# EAGLE design hdmi_trigger_interface (EAGLE 9.3.1)

## Sheet 1 of 4: MojoV3 Connections
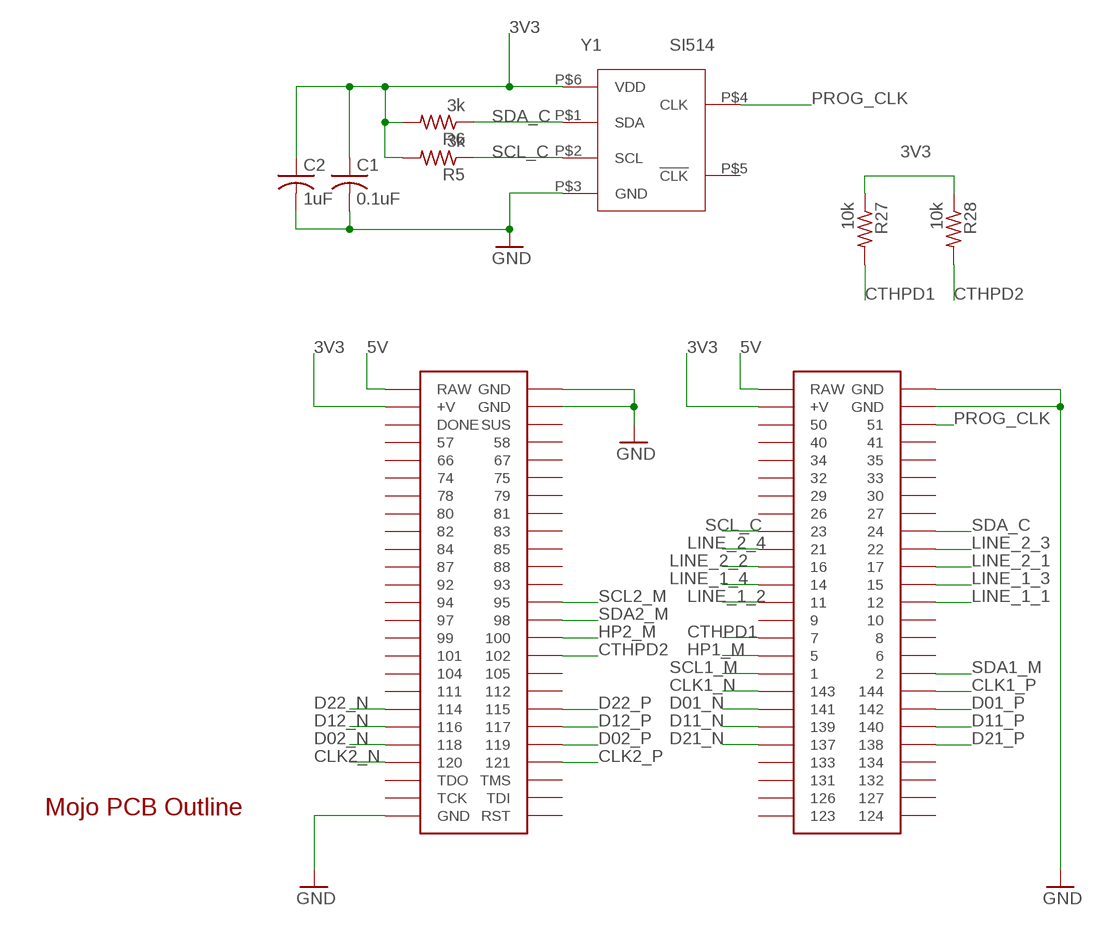
[diagram p0: schematic, sheet 1]

### Parts
C1  0.1uF  C-USC0603  [C0603]
C2  1uF  C-USC0603  [C0603]
R5  3k  R-US_R0603  [R0603]
R6  3k  R-US_R0603  [R0603]
R27  10k  R-US_R0603  [R0603]
R28  10k  R-US_R0603  [R0603]
U$1  MOJOV3  [MOJO_V3]
U$2  MOJO_OUTLINE  [MOJO_OUTLINE]
Y1  SI514  [XTAL-6PIN]

### Nets
3V3: C1.1 C2.1 R5.2 R6.2 R27.1 R28.1 U$1.V@1(+V) U$1.V@2(+V) Y1.P$6(VDD) ; also sheet 2,4
5V: U$1.RAW@1(RAW) U$1.RAW@2(RAW) ; also sheet 2
CLK1_N [diff]: U$1.143 ; also sheet 2,3
CLK1_P [diff]: U$1.144 ; also sheet 2,3
CLK2_N [diff]: U$1.120 ; also sheet 2,3
CLK2_P [diff]: U$1.121 ; also sheet 2,3
CTHPD1: R27.2 U$1.7 ; also sheet 2
CTHPD2: R28.2 U$1.102 ; also sheet 2
D01_N [diff]: U$1.141 ; also sheet 2,3
D01_P [diff]: U$1.142 ; also sheet 2,3
D02_N [diff]: U$1.118 ; also sheet 2,3
D02_P [diff]: U$1.119 ; also sheet 2,3
D11_N [diff]: U$1.139 ; also sheet 2,3
D11_P [diff]: U$1.140 ; also sheet 2,3
D12_N [diff]: U$1.116 ; also sheet 2,3
D12_P [diff]: U$1.117 ; also sheet 2,3
D21_N [diff]: U$1.137 ; also sheet 2,3
D21_P [diff]: U$1.138 ; also sheet 2,3
D22_N [diff]: U$1.114 ; also sheet 2,3
D22_P [diff]: U$1.115 ; also sheet 2,3
GND: C1.2 C2.2 U$1.GND@1(GND) U$1.GND@2(GND) U$1.GND@3(GND) U$1.GND@4(GND) U$1.GND@6(GND) Y1.P$3(GND) ; also sheet 2,3,4
HP1_M: U$1.5 ; also sheet 2
HP2_M: U$1.100 ; also sheet 2
LINE_1_1: U$1.12 ; also sheet 4
LINE_1_2: U$1.11 ; also sheet 4
LINE_1_3: U$1.15 ; also sheet 4
LINE_1_4: U$1.14 ; also sheet 4
LINE_2_1: U$1.17 ; also sheet 4
LINE_2_2: U$1.16 ; also sheet 4
LINE_2_3: U$1.22 ; also sheet 4
LINE_2_4: U$1.21 ; also sheet 4
PROG_CLK: U$1.51 Y1.P$4(CLK)
SCL1_M: U$1.1 ; also sheet 2
SCL2_M: U$1.95 ; also sheet 2
SCL_C: R5.1 U$1.23 Y1.P$2(SCL)
SDA1_M: U$1.2 ; also sheet 2
SDA2_M: U$1.98 ; also sheet 2
SDA_C: R6.1 U$1.24 Y1.P$1(SDA)
Unconnected: U$1.6 U$1.8 U$1.9 U$1.10 U$1.26 U$1.27 U$1.29 U$1.30 U$1.32 U$1.33 U$1.34 U$1.35 U$1.40 U$1.41 U$1.50 U$1.57 U$1.58 U$1.66 U$1.67 U$1.74 U$1.75 U$1.78 U$1.79 U$1.80 U$1.81 U$1.82 U$1.83 U$1.84 U$1.85 U$1.87 U$1.88 U$1.92 U$1.93 U$1.94 U$1.97 U$1.99 U$1.101 U$1.104 U$1.105 U$1.111 U$1.112 U$1.123 U$1.124 U$1.126 U$1.127 U$1.131 U$1.132 U$1.133 U$1.134 U$1.DONE U$1.RST U$1.SUS U$1.TCK U$1.TDI U$1.TDO U$1.TMS Y1.P$5(!CLK)

## Sheet 2 of 4: HDMI Protection and Level Shifting
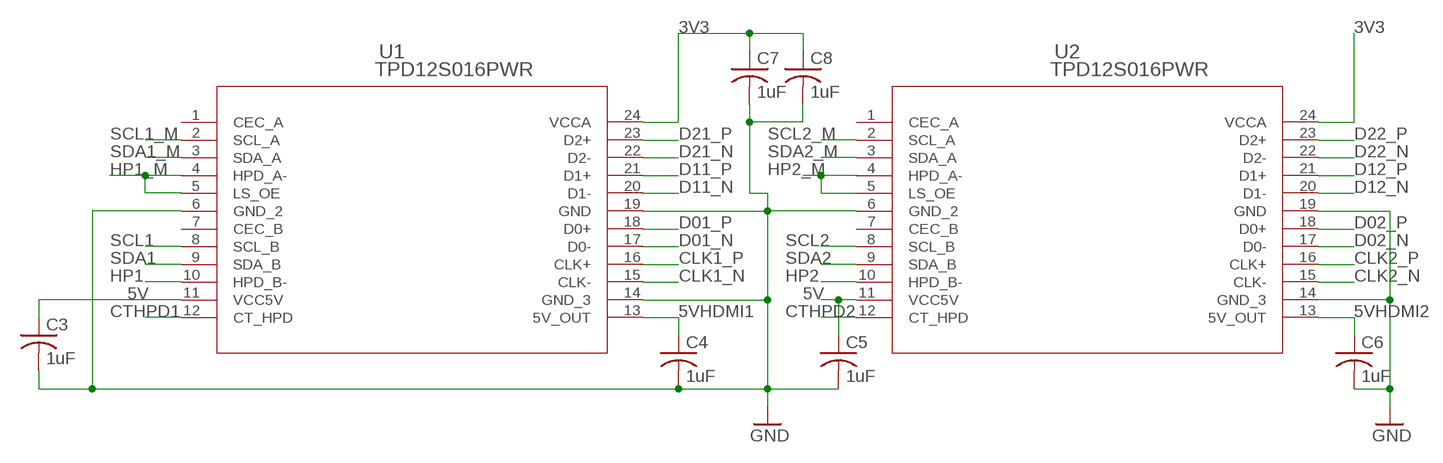
[diagram p1: schematic, sheet 2]

### Parts
C3  1uF  C-USC0603  [C0603]
C4  1uF  C-USC0603  [C0603]
C5  1uF  C-USC0603  [C0603]
C6  1uF  C-USC0603  [C0603]
C7  1uF  C-USC0603  [C0603]
C8  1uF  C-USC0603  [C0603]
U1  TPD12S016PWR  [PW24]
U2  TPD12S016PWR  [PW24]

### Nets
3V3: C7.1 C8.1 U1.24(VCCA) U2.24(VCCA) ; also sheet 1,4
5V: C3.1 C5.1 U1.11(VCC5V) U2.11(VCC5V) ; also sheet 1
5VHDMI1: C4.1 U1.13(5V_OUT) ; also sheet 3
5VHDMI2: C6.1 U2.13(5V_OUT) ; also sheet 3
CLK1_N [diff]: U1.15(CLK-) ; also sheet 1,3
CLK1_P [diff]: U1.16(CLK+) ; also sheet 1,3
CLK2_N [diff]: U2.15(CLK-) ; also sheet 1,3
CLK2_P [diff]: U2.16(CLK+) ; also sheet 1,3
CTHPD1: U1.12(CT_HPD) ; also sheet 1
CTHPD2: U2.12(CT_HPD) ; also sheet 1
D01_N [diff]: U1.17(D0-) ; also sheet 1,3
D01_P [diff]: U1.18(D0+) ; also sheet 1,3
D02_N [diff]: U2.17(D0-) ; also sheet 1,3
D02_P [diff]: U2.18(D0+) ; also sheet 1,3
D11_N [diff]: U1.20(D1-) ; also sheet 1,3
D11_P [diff]: U1.21(D1+) ; also sheet 1,3
D12_N [diff]: U2.20(D1-) ; also sheet 1,3
D12_P [diff]: U2.21(D1+) ; also sheet 1,3
D21_N [diff]: U1.22(D2-) ; also sheet 1,3
D21_P [diff]: U1.23(D2+) ; also sheet 1,3
D22_N [diff]: U2.22(D2-) ; also sheet 1,3
D22_P [diff]: U2.23(D2+) ; also sheet 1,3
GND: C3.2 C4.2 C5.2 C6.2 C7.2 C8.2 U1.6(GND_2) U1.14(GND_3) U1.19(GND) U2.6(GND_2) U2.14(GND_3) U2.19(GND) ; also sheet 1,3,4
HP1: U1.10(HPD_B-) ; also sheet 3
HP1_M: U1.4(HPD_A-) U1.5(LS_OE) ; also sheet 1
HP2: U2.10(HPD_B-) ; also sheet 3
HP2_M: U2.4(HPD_A-) U2.5(LS_OE) ; also sheet 1
SCL1: U1.8(SCL_B) ; also sheet 3
SCL1_M: U1.2(SCL_A) ; also sheet 1
SCL2: U2.8(SCL_B) ; also sheet 3
SCL2_M: U2.2(SCL_A) ; also sheet 1
SDA1: U1.9(SDA_B) ; also sheet 3
SDA1_M: U1.3(SDA_A) ; also sheet 1
SDA2: U2.9(SDA_B) ; also sheet 3
SDA2_M: U2.3(SDA_A) ; also sheet 1
Unconnected: U1.1(CEC_A) U1.7(CEC_B) U2.1(CEC_A) U2.7(CEC_B)

## Sheet 3 of 4: HDMI Ports
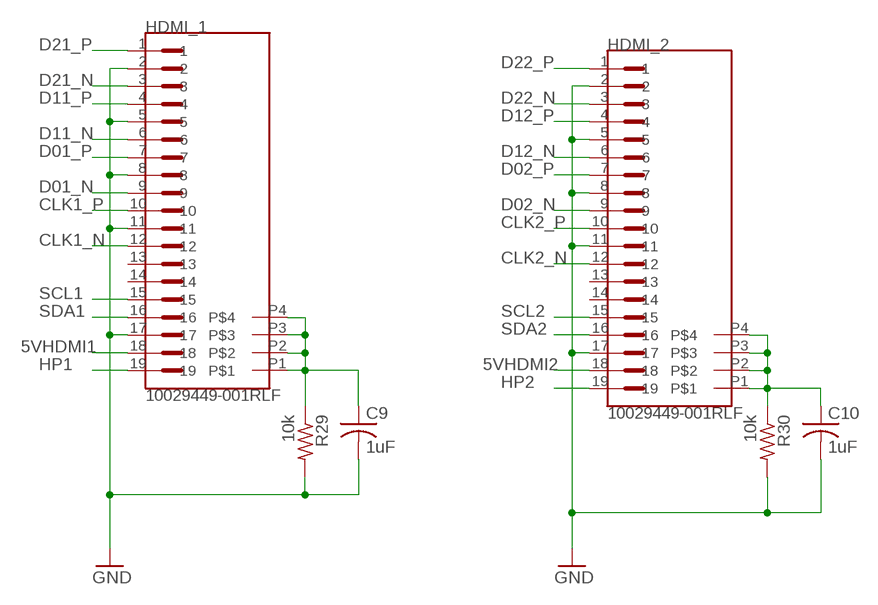
[diagram p2: schematic, sheet 3]

### Parts
C9  1uF  C-USC0603  [C0603]
C10  1uF  C-USC0603  [C0603]
HDMI_1  10029449-001RLF  [FCI_10029449-001RLF]
HDMI_2  10029449-001RLF  [FCI_10029449-001RLF]
R29  10k  R-US_R0603  [R0603]
R30  10k  R-US_R0603  [R0603]

### Nets
5VHDMI1: HDMI_1.18 ; also sheet 2
5VHDMI2: HDMI_2.18 ; also sheet 2
CLK1_N [diff]: HDMI_1.12 ; also sheet 1,2
CLK1_P [diff]: HDMI_1.10 ; also sheet 1,2
CLK2_N [diff]: HDMI_2.12 ; also sheet 1,2
CLK2_P [diff]: HDMI_2.10 ; also sheet 1,2
D01_N [diff]: HDMI_1.9 ; also sheet 1,2
D01_P [diff]: HDMI_1.7 ; also sheet 1,2
D02_N [diff]: HDMI_2.9 ; also sheet 1,2
D02_P [diff]: HDMI_2.7 ; also sheet 1,2
D11_N [diff]: HDMI_1.6 ; also sheet 1,2
D11_P [diff]: HDMI_1.4 ; also sheet 1,2
D12_N [diff]: HDMI_2.6 ; also sheet 1,2
D12_P [diff]: HDMI_2.4 ; also sheet 1,2
D21_N [diff]: HDMI_1.3 ; also sheet 1,2
D21_P [diff]: HDMI_1.1 ; also sheet 1,2
D22_N [diff]: HDMI_2.3 ; also sheet 1,2
D22_P [diff]: HDMI_2.1 ; also sheet 1,2
GND: C9.2 C10.2 HDMI_1.2 HDMI_1.5 HDMI_1.8 HDMI_1.11 HDMI_1.17 HDMI_2.2 HDMI_2.5 HDMI_2.8 HDMI_2.11 HDMI_2.17 R29.2 R30.2 ; also sheet 1,2,4
HP1: HDMI_1.19 ; also sheet 2
HP2: HDMI_2.19 ; also sheet 2
N$13: C9.1 HDMI_1.P1 HDMI_1.P2 HDMI_1.P3 HDMI_1.P4 R29.1
N$14: C10.1 HDMI_2.P1 HDMI_2.P2 HDMI_2.P3 HDMI_2.P4 R30.1
SCL1: HDMI_1.15 ; also sheet 2
SCL2: HDMI_2.15 ; also sheet 2
SDA1: HDMI_1.16 ; also sheet 2
SDA2: HDMI_2.16 ; also sheet 2
Unconnected: HDMI_1.13 HDMI_1.14 HDMI_2.13 HDMI_2.14

## Sheet 4 of 4: Camera Trigger Interface
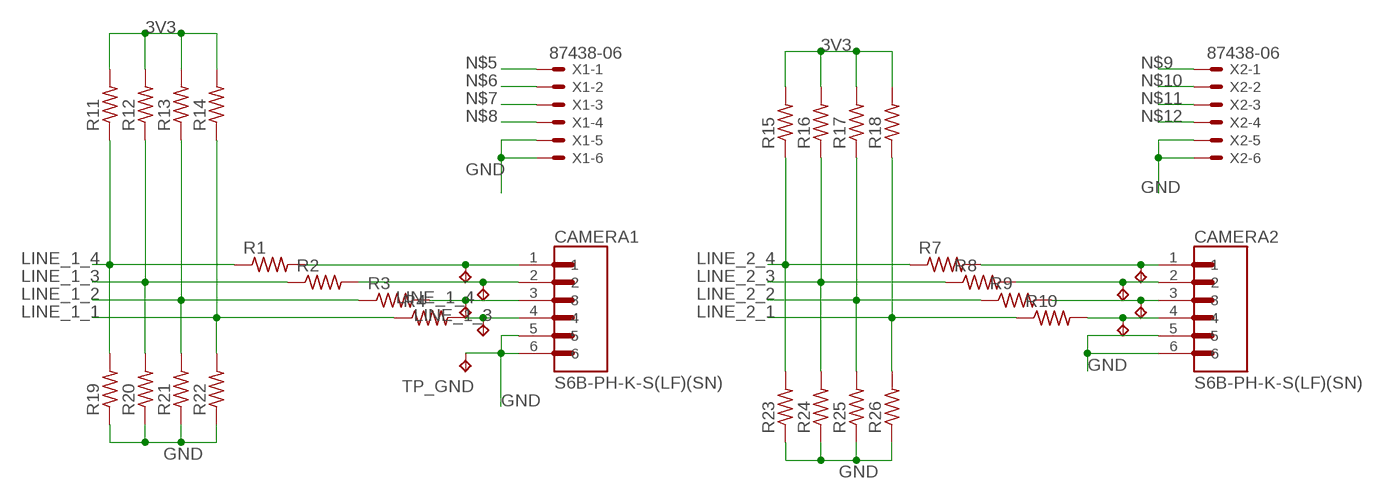
[diagram p3: schematic, sheet 4]

### Parts
CAMERA1  S6B-PH-K-S(LF)(SN)  [JST_S6B-PH-K-S(LF)(SN)]
CAMERA2  S6B-PH-K-S(LF)(SN)  [JST_S6B-PH-K-S(LF)(SN)]
LINE_1_1  TPTP16R  [TP16R]
LINE_1_2  TPTP16R  [TP16R]
LINE_1_3  TPTP16R  [TP16R]
LINE_1_4  TPTP16R  [TP16R]
LINE_2_1  LINE_1  TPTP16R  [TP16R]
LINE_2_2  LINE_2  TPTP16R  [TP16R]
LINE_2_3  LINE_3  TPTP16R  [TP16R]
LINE_4  LINE_1  TPTP16R  [TP16R]
R1  R-US_R0603  [R0603]
R2  R-US_R0603  [R0603]
R3  R-US_R0603  [R0603]
R4  R-US_R0603  [R0603]
R7  R-US_R0603  [R0603]
R8  R-US_R0603  [R0603]
R9  R-US_R0603  [R0603]
R10  R-US_R0603  [R0603]
R11  R-US_R0603  [R0603]
R12  R-US_R0603  [R0603]
R13  R-US_R0603  [R0603]
R14  R-US_R0603  [R0603]
R15  R-US_R0603  [R0603]
R16  R-US_R0603  [R0603]
R17  R-US_R0603  [R0603]
R18  R-US_R0603  [R0603]
R19  R-US_R0603  [R0603]
R20  R-US_R0603  [R0603]
R21  R-US_R0603  [R0603]
R22  R-US_R0603  [R0603]
R23  R-US_R0603  [R0603]
R24  R-US_R0603  [R0603]
R25  R-US_R0603  [R0603]
R26  R-US_R0603  [R0603]
TP_GND  TPTP16R  [TP16R]
X1  87438-06  [87438-06]
X2  87438-06  [87438-06]

### Nets
3V3: R11.2 R12.2 R13.2 R14.2 R15.2 R16.2 R17.2 R18.2 ; also sheet 1,2
GND: CAMERA1.5 CAMERA1.6 CAMERA2.5 CAMERA2.6 R19.1 R20.1 R21.1 R22.1 R23.1 R24.1 R25.1 R26.1 TP_GND.TP X1.5 X1.6 X2.5 X2.6 ; also sheet 1,2,3
LINE_1_1: R4.1 R14.1 R22.2 ; also sheet 1
LINE_1_2: R3.1 R13.1 R21.2 ; also sheet 1
LINE_1_3: R2.1 R12.1 R20.2 ; also sheet 1
LINE_1_4: R1.1 R11.1 R19.2 ; also sheet 1
LINE_2_1: R10.1 R18.1 R26.2 ; also sheet 1
LINE_2_2: R9.1 R17.1 R25.2 ; also sheet 1
LINE_2_3: R8.1 R16.1 R24.2 ; also sheet 1
LINE_2_4: R7.1 R15.1 R23.2 ; also sheet 1
N$5: CAMERA1.1 LINE_1_4.TP R1.2 X1.1
N$6: CAMERA1.2 LINE_1_3.TP R2.2 X1.2
N$7: CAMERA1.3 LINE_1_2.TP R3.2 X1.3
N$8: CAMERA1.4 LINE_1_1.TP R4.2 X1.4
N$9: CAMERA2.1 LINE_4.TP R7.2 X2.1
N$10: CAMERA2.2 LINE_2_3.TP R8.2 X2.2
N$11: CAMERA2.3 LINE_2_2.TP R9.2 X2.3
N$12: CAMERA2.4 LINE_2_1.TP R10.2 X2.4

## Library data of the parts
C1-C10 = rcl:C-US: CAPACITOR, American symbol; SPICEPREFIX: C
CAMERA1 CAMERA2 = S6B-PH-K-S_LF__SN_:S6B-PH-K-S(LF)(SN): PH Series 6 Position 2 mm Pitch Through Hole Side Entry Shrouded Header; DESCRIPTION: PH Series 6 Position 2 mm Pitch Through Hole Side Entry Shrouded Header; DIGI-KEY_PART_NUMBER: 455-1723-ND; DIGI-KEY_PURCHASE_URL: https://www.digikey.com/product-detail/en/jst-sales-america-inc/S6B-PH-K-S_LF__SN_/455-1723-ND/926630?utm_source=snapeda&utm_medium=aggregator&utm_campaign=symbol; MF: JST Sales; MP: S6B-PH-K-S_LF__SN_; PACKAGE: None
HDMI_1 HDMI_2 = 10029449-001RLF:10029449-001RLF: Conn; Data; HDMI; Jack; TypeA; 90Deg; PartialSMT(ThruHoleForShellPeg); 19Cnts; w/oFlange; AVAILABILITY: Unavailable; DESCRIPTION: Connectors, Connectors and Adapters; MF: Amphenol FCI; MP: 10029449-001RLF; PACKAGE: None; PRICE: None
LINE_1_1-LINE_1_4 LINE_2_1-LINE_2_3 LINE_4 TP_GND = testpad:TP: Test pad
R1-R30 = rcl:R-US_: RESISTOR, American symbol; SPICEPREFIX: R
U1 U2 = TPD12S016:TPD12S016PWR: HDMI, I²C Buffer, ESD Protection Interface 24-TSSOP; MANUFACTURER_PART_NUMBER: TPD12S016PWR; VENDOR: Texas Instruments
U$1 = EmbeddedMicro-Mojo:MOJO
U$2 = EmbeddedMicro-Mojo:MOJO_OUTLINE
X1 X2 = con-molex:87438-06: Wire-to-Board 1.50mm (.059") Pitch Header - Right Angle, SMT, Shrouded Source: http://www.molex.com/product/micro/87438.html; MF: MOLEX; MPN: 87438-0643; OC_FARNELL: 1756938; OC_NEWARK: 88K3155
Y1 = lupa300-components:SI514

## Net classes
1 diff: width 0.203 mm, clearance 0.203 mm to class 0, clearance 0.203 mm

## Board
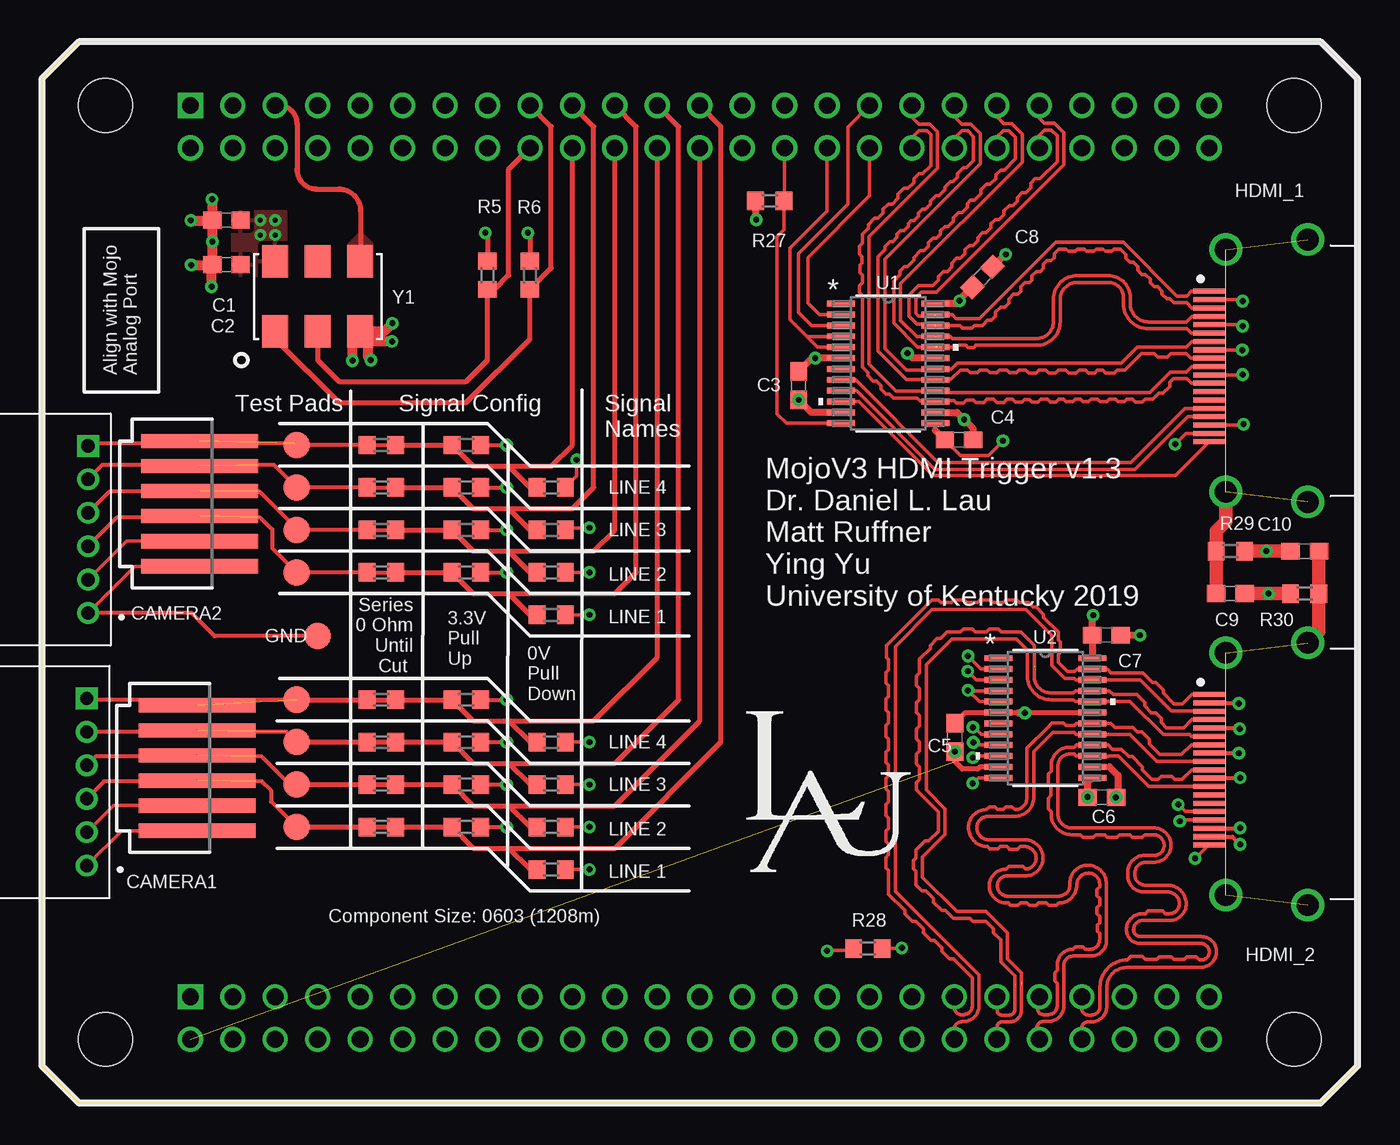
[diagram p4: board, top side]
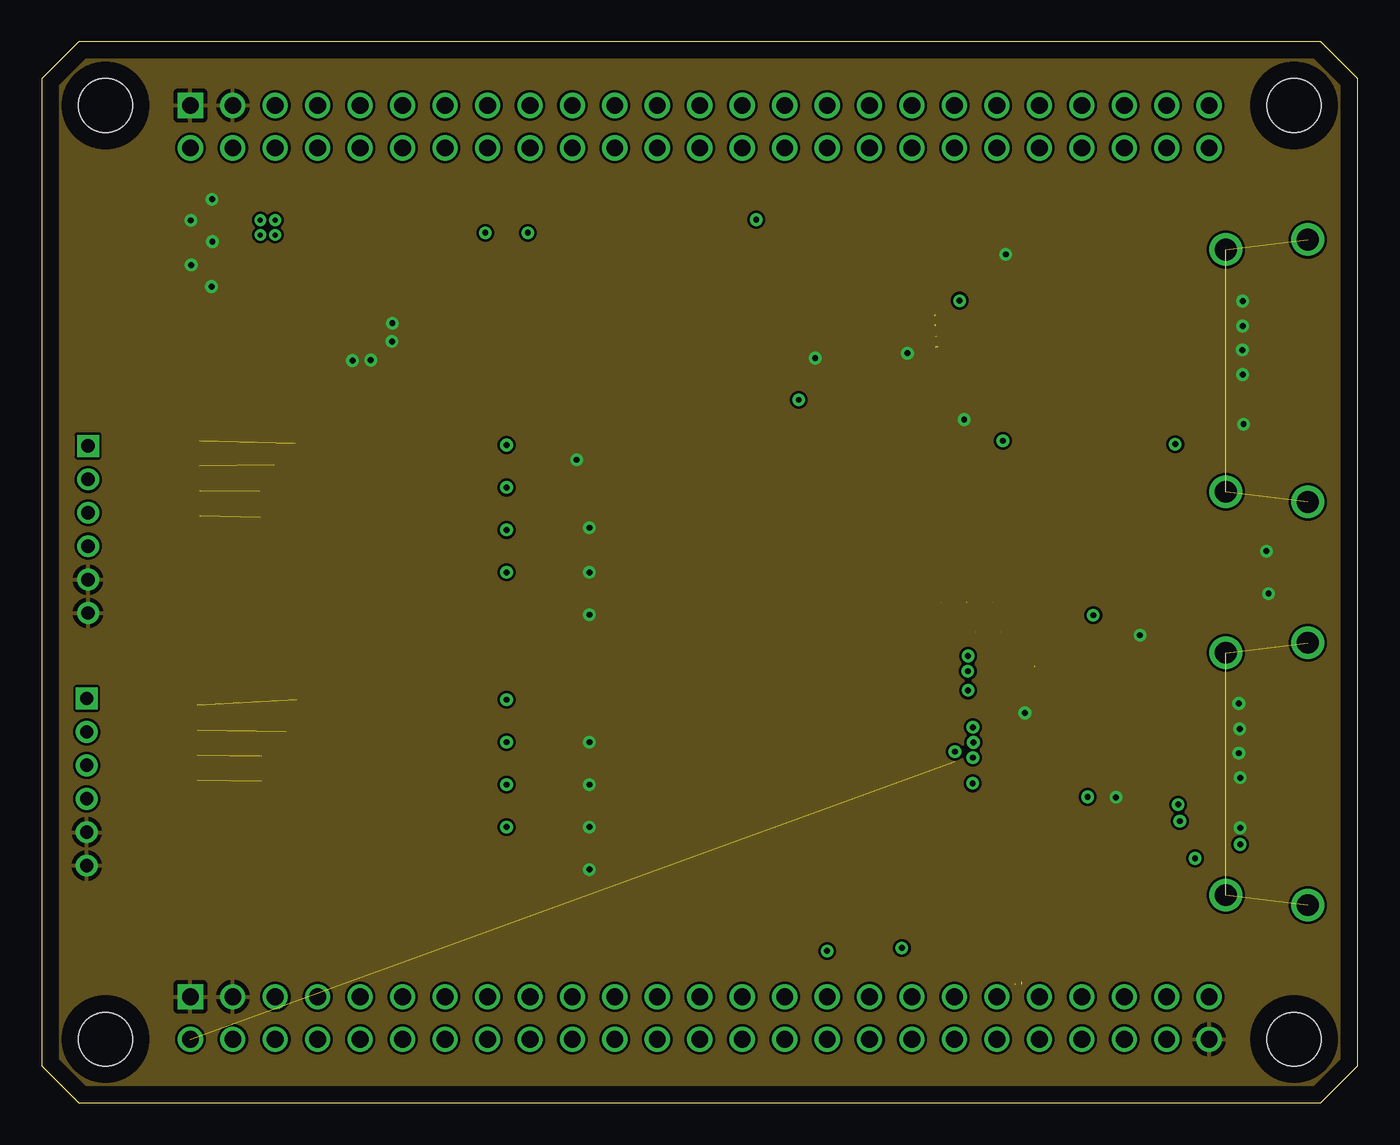
[diagram p5: board, inner layer Route2]
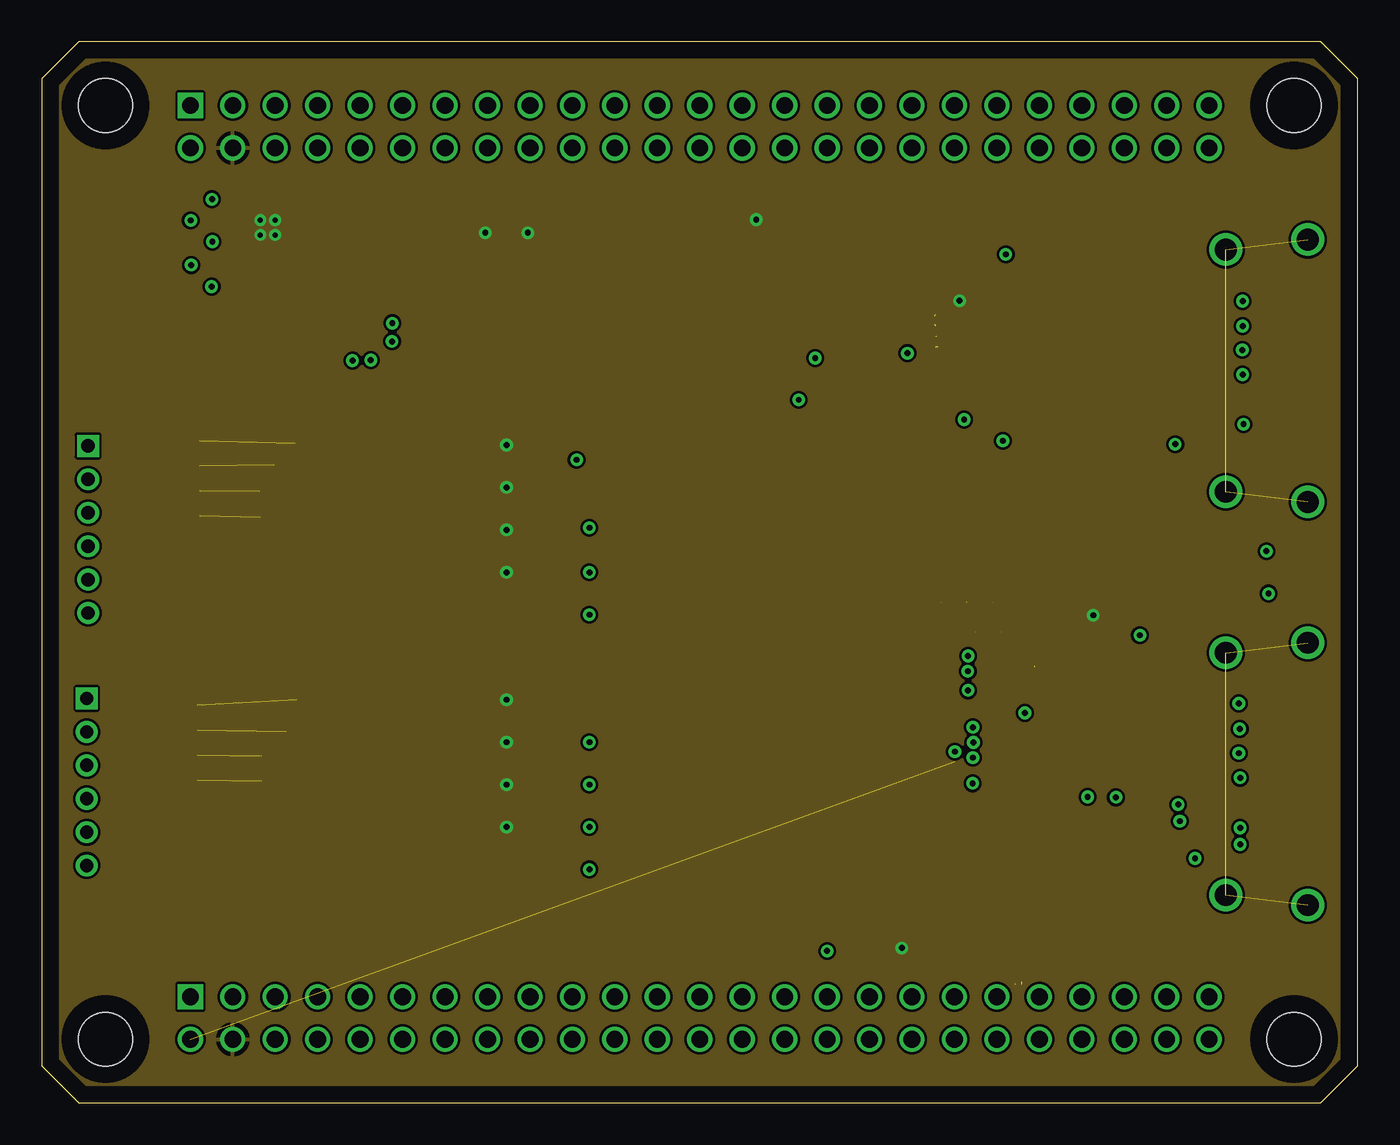
[diagram p6: board, inner layer Route15]
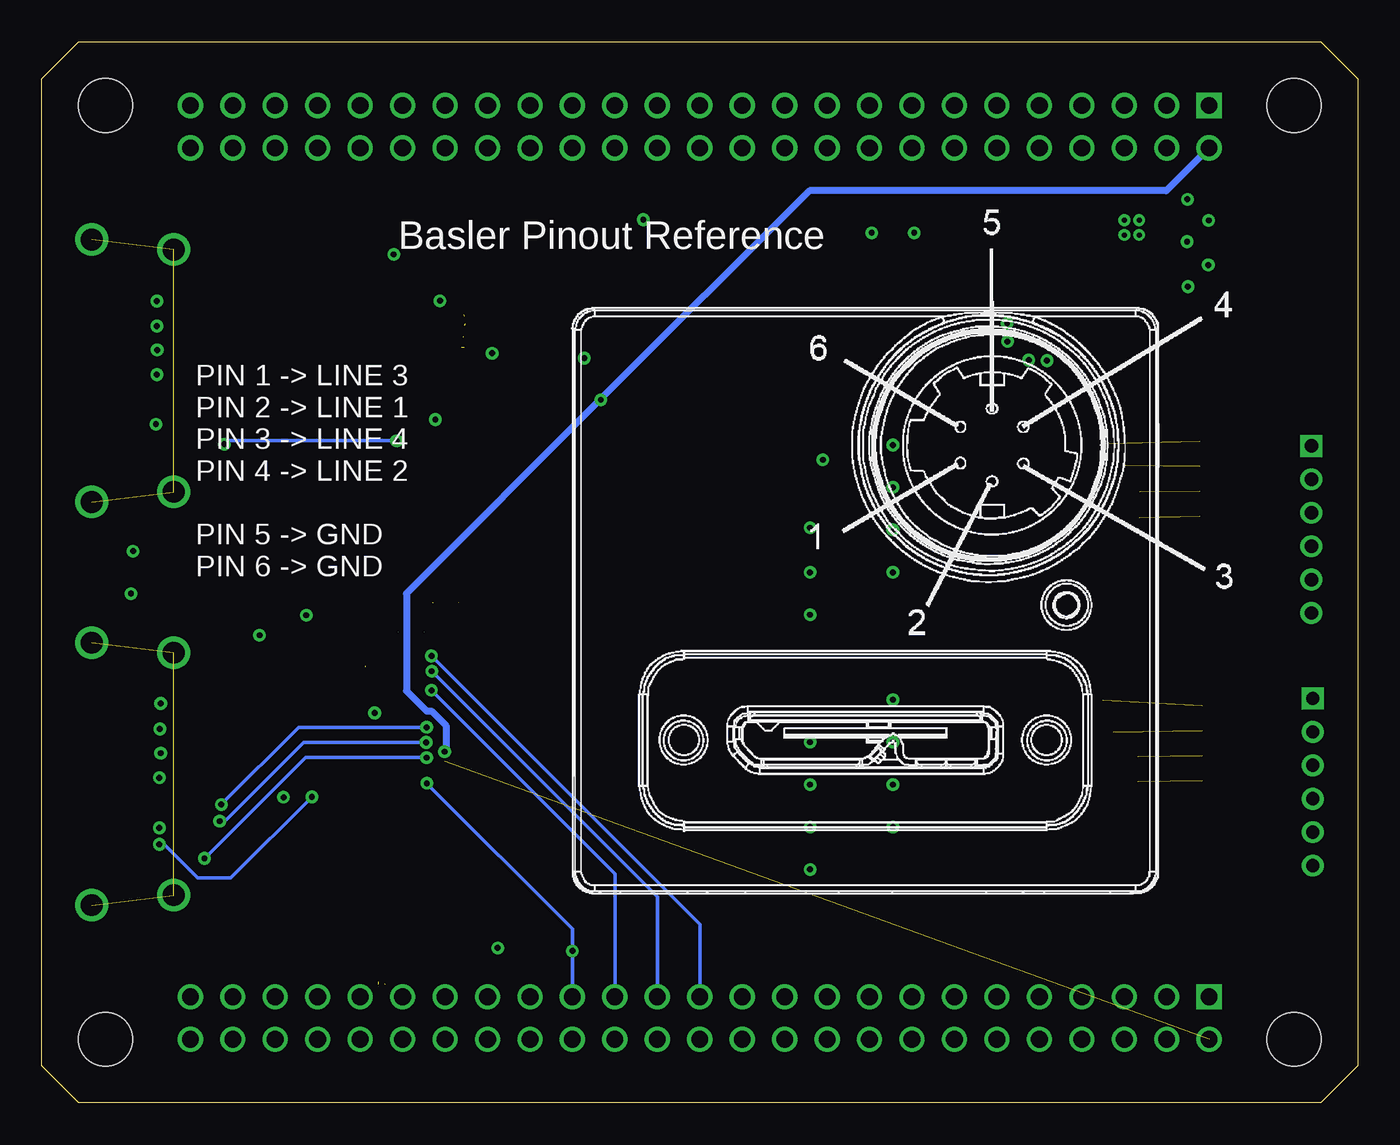
[diagram p7: board, bottom side, seen from below]

Size 78.74 x 63.5 mm. Coordinates in mm from the lower left corner, seen from the top.
Copper layers (1+2*15+16): Top 0.035mm / dielectric 0.175mm / Route2 0.035mm / dielectric 0.53mm / Route15 0.035mm / dielectric 0.175mm / Bottom 0.035mm
Design rules "default *": minimum track width 6mil, minimum drill 0.35mm, track to track 6mil, track to pad 6mil, pad to pad 6mil, via to via 6mil, smd to smd 6mil, copper to edge 40mil, drill to drill 6mil, minimum pad ring 10mil, minimum via ring 8mil, stop-mask expansion 4mil, vias tented up to drill 20mil, thermal gap 10mil

### Footprints (pad centres in the part's own frame; a part is rotated, then mirrored left to right if it is on the bottom)
C0603 = smd 1.1 x 1: 1 -0.85,0; 2 0.85,0
JST_S6B-PH-K-S(LF)(SN) = drill 0.8 square: 1 -5,0 | drill 0.8: 2 -3,0; 3 -1,0; 4 1,0; 5 3,0; 6 5,0
FCI_10029449-001RLF = smd 0.3 x 1.9: 1 4.75,0; 2 4.25,0; 3 3.75,0; 4 3.25,0; 5 2.75,0; 6 2.25,0; 7 1.75,0; 8 1.25,0; 9 0.75,0; 10 0.25,0; 11 -0.25,0; 12 -0.75,0; 13 -1.25,0; 14 -1.75,0; 15 -2.25,0; 16 -2.75,0; 17 -3.25,0; 18 -3.75,0; 19 -4.25,0 | drill 1.3: P1 7.25,-1; P2 -7.25,-1; P3 -7.85,-5.9; P4 7.85,-5.9
TP16R = smd 1.6 x 1.6: TP 0,0
R0603 = smd 1 x 1.1: 1 -0.85,0; 2 0.85,0
PW24 = smd 1.676 x 0.356: 1 -2.819,3.575; 2 -2.819,2.925; 3 -2.819,2.275; 4 -2.819,1.625; 5 -2.819,0.975; 6 -2.819,0.325; 7 -2.819,-0.325; 8 -2.819,-0.975; 9 -2.819,-1.625; 10 -2.819,-2.275; 11 -2.819,-2.925; 12 -2.819,-3.575; 13 2.819,-3.575; 14 2.819,-2.925; 15 2.819,-2.275; 16 2.819,-1.625; 17 2.819,-0.975; 18 2.819,-0.325; 19 2.819,0.325; 20 2.819,0.975; 21 2.819,1.625; 22 2.819,2.275; 23 2.819,2.925; 24 2.819,3.575
MOJO_V3 = drill 1: 1 49.53,57.15; 2 49.53,59.69; 5 46.99,57.15; 6 46.99,59.69; 7 44.45,57.15; 8 44.45,59.69; 9 41.91,57.15; 10 41.91,59.69; 11 39.37,57.15; 12 39.37,59.69; 14 36.83,57.15; 15 36.83,59.69; 16 34.29,57.15; 17 34.29,59.69; 21 31.75,57.15; 22 31.75,59.69; 23 29.21,57.15; 24 29.21,59.69; 26 26.67,57.15; 27 26.67,59.69; 29 24.13,57.15; 30 24.13,59.69; 32 21.59,57.15; 33 21.59,59.69; 34 19.05,57.15; 35 19.05,59.69; 40 16.51,57.15; 41 16.51,59.69; 50 13.97,57.15; 51 13.97,59.69; 57 16.51,3.81; 58 16.51,6.35; 66 19.05,3.81; 67 19.05,6.35; 74 21.59,3.81; 75 21.59,6.35; 78 24.13,3.81; 79 24.13,6.35; 80 26.67,3.81; 81 26.67,6.35; 82 29.21,3.81; 83 29.21,6.35; 84 31.75,3.81; 85 31.75,6.35; 87 34.29,3.81; 88 34.29,6.35; 92 36.83,3.81; 93 36.83,6.35; 94 39.37,3.81; 95 39.37,6.35; 97 41.91,3.81; 98 41.91,6.35; 99 44.45,3.81; 100 44.45,6.35; 101 46.99,3.81; 102 46.99,6.35; 104 49.53,3.81; 105 49.53,6.35; 111 52.07,3.81; 112 52.07,6.35; 114 54.61,3.81; 115 54.61,6.35; 116 57.15,3.81; 117 57.15,6.35; 118 59.69,3.81; 119 59.69,6.35; 120 62.23,3.81; 121 62.23,6.35; 123 69.85,57.15; 124 69.85,59.69; 126 67.31,57.15; 127 67.31,59.69; 131 64.77,57.15; 132 64.77,59.69; 133 62.23,57.15; 134 62.23,59.69; 137 59.69,57.15; 138 59.69,59.69; 139 57.15,57.15; 140 57.15,59.69; 141 54.61,57.15; 142 54.61,59.69; 143 52.07,57.15; 144 52.07,59.69; DONE 13.97,3.81; GND@2 11.43,59.69; GND@4 11.43,6.35; GND@6 69.85,3.81; RAW@1 8.89,57.15; RAW@2 8.89,3.81; RST 69.85,6.35; SUS 13.97,6.35; TCK 67.31,3.81; TDI 67.31,6.35; TDO 64.77,3.81; TMS 64.77,6.35; V@1 11.43,57.15; V@2 11.43,3.81 | drill 1 square: GND@1 8.89,59.69; GND@3 8.89,6.35 | hole 3.2: 3.81,3.81; 3.81,59.69; 74.93,59.69; 74.93,3.81
87438-06 = smd 7 x 0.85: 1 0,3.75; 2 0,2.25; 3 0,0.75; 4 0,-0.75; 5 0,-2.25; 6 0,-3.75
XTAL-6PIN = smd 1.95 x 1.55: P$1 -2.1,2.54; P$2 -2.1,0; P$3 -2.1,-2.54; P$4 2.1,-2.54; P$5 2.1,0; P$6 2.1,2.54

### Placement (x,y rotation side)
C1  11.05,52.83 180 top
C2  11.05,50.16 180 top
C3  45.29,42.93 90 top
C4  54.89,39.67 0 top
C5  54.64,21.87 90 top
C6  63.42,18.29 0 top
C7  63.7,27.99 0 top
C8  56.29,49.43 45 top
C9  71.12,30.48 0 top
C10  75.56,33.02 180 top
CAMERA1  2.69,19.2 270 top
CAMERA2  2.77,34.32 270 top
HDMI_1  69.85,43.81 90 top
HDMI_2  69.85,19.68 90 top
LINE_1_1  15.24,16.51 0 top
LINE_1_2  15.24,19.05 0 top
LINE_1_3  15.24,21.59 0 top
LINE_1_4  15.24,24.13 0 top
LINE_2_1  15.24,31.75 0 top
LINE_2_2  15.24,34.29 0 top
LINE_2_3  15.24,36.83 0 top
LINE_4  15.24,39.37 0 top
R1  20.32,24.13 180 top
R2  20.32,21.59 180 top
R3  20.32,19.05 180 top
R4  20.32,16.51 180 top
R5  26.67,49.53 90 top
R6  29.21,49.53 90 top
R7  20.32,39.37 180 top
R8  20.32,36.83 180 top
R9  20.32,34.29 180 top
R10  20.32,31.75 180 top
R11  25.4,24.13 0 top
R12  25.4,21.59 0 top
R13  25.4,19.05 0 top
R14  25.4,16.51 0 top
R15  25.4,39.37 0 top
R16  25.4,36.83 0 top
R17  25.4,34.29 0 top
R18  25.4,31.75 0 top
R19  30.48,21.59 180 top
R20  30.48,19.05 180 top
R21  30.48,16.51 180 top
R22  30.48,13.97 180 top
R23  30.48,36.83 180 top
R24  30.48,34.29 180 top
R25  30.48,31.75 180 top
R26  30.48,29.21 180 top
R27  43.56,53.98 0 top
R28  49.43,9.25 180 top
R29  71.12,33.02 0 top
R30  75.56,30.48 180 top
TP_GND  16.51,27.94 0 top
U1  50.65,44.25 0 top
U2  60.05,23.04 0 top
U$1  0,0 0 top
U$2  0,0 0 top
X1  9.3,20.04 0 top
X2  9.45,35.86 0 top
Y1  16.51,48.26 90 top

### Tracks (layer width: path | path; a pad name or v marks a point on that pad's centre or on a via)
3V3  (via drill 0.3, 0.35)
  Top 0.203: 62.85,29.12 v62.92,29.18 | C7.1 62.87,27.98 | R28.1 51.44,9.25 v51.46,9.27 | 54.91,48.06 v54.91,48.01 | U1.24
  Top 0.254: R15.2 v27.81,39.37 | R16.2 v27.81,36.83 | R17.2 v27.81,34.29 | R18.2 v27.81,31.75 | R11.2 v27.81,24.13 | R12.2 v27.81,21.59 | R13.2 v27.81,19.05 | R14.2 v27.81,16.51
  Top 0.305: v26.54,52.07 26.67,51.94 R5.2 | v29.08,52.07 29.21,51.94 R6.2
  Top 0.406: C7.1 62.85,29.12 | 62.87,27.98 U2.24 | C8.1 54.91,48.06 | v54.91,48.01 54.74,47.83 U1.24 | R27.1 42.71,52.9 v42.75,52.86
  other vias: 13.08,52.83 13.97,52.83 13.97,51.94 13.08,51.94
  pour Top: 11.43,53.34 11.43,49.53 14.61,49.53 14.61,53.34
  pour Route15: 77.6,64.03 2.74,64.03 0.13,61.47 0.13,1.8 2.67,-0.74 77.6,-0.74 80.14,1.8 80.14,61.49
5V  (via drill 0.35)  (1 unrouted)
  Top 0.305: U2.11 56.13,20.11 56,19.98 55.08,19.98 54.63,20.42 C5.1
  Top 0.406: U1.11 46.04,41.32 C3.1
  Bottom 0.203: C3.1 45.33,42.08 45.35,42.05
  Bottom 0.406: U$1.RAW@1 11.46,54.59 32.82,54.59 45.35,42.05 56.92,30.48 56.92,24.66 55.7,23.44 55.42,23.44 54.56,22.58 54.56,21.06 54.6,21.02 C5.1
  other vias: 54.64,21.02 45.29,42.08
5VHDMI1  (via drill 0.35)
  Top 0.203: 53.47,40.25 U1.13 | C4.1 54.98,38.73 56.64,38.73 57.51,39.6 v57.51,39.62 | v67.82,39.42 68.47,40.06 HDMI_1.18
  Top 0.406: C4.1 53.47,40.25
  Bottom 0.203: v57.51,39.62 67.54,39.62 67.82,39.34 | 67.84,39.32 67.82,39.34 | 67.82,39.34 v67.82,39.42
5VHDMI2  (via drill 0.35)
  Top 0.254: HDMI_2.18 71.24,15.94 v71.7,15.47
  Top 0.305: v62.57,18.31 C6.1
  Top 0.406: U2.13 62.57,19.17 v62.57,18.31
  Bottom 0.203: 71.42,15.47 69.42,13.46 67.44,13.46 62.57,18.32
  Bottom 0.254: v71.7,15.47 71.42,15.47 | 62.56,18.34 62.57,18.32 v62.57,18.31
CLK1_N
  Top 0.203: HDMI_1.12 68.77,43.06 68.5,43.33 67.7,43.33 67.49,43.12 67.49,42.88 67.08,42.47 66.83,42.47 66.48,42.11 66.04,42.11 65.86,41.94 65.43,41.94 65.25,42.11 64.92,42.11 64.77,41.96 64.39,41.96 64.24,42.11 63.88,42.11 63.73,41.96 63.32,41.96 63.17,42.11 62.79,42.11 62.64,41.96 62.31,41.96 62.15,42.11 61.85,42.11 61.7,41.96 61.29,41.96 61.14,42.11 60.86,42.11 60.68,41.94 60.35,41.94 60.17,42.11 59.79,42.11 59.61,41.94 59.26,41.94 59.11,42.09 58.8,42.09 58.65,41.94 58.24,41.94 58.06,42.11 57.76,42.11 57.56,41.91 57.15,41.91 56.95,42.11 56.57,42.11 56.36,41.91 55.91,41.91 55.75,42.06 55.32,42.06 55.14,41.88 54.74,41.88 54.59,42.04 53.53,42.04 U1.15 53.45,41.99 52.58,41.99 52.38,42.19 50.94,42.19 50.72,42.42 50.52,42.42 50.22,42.72 50.22,42.92 49.93,43.2 49.73,43.2 49.43,43.51 49.43,43.7 49.1,44.04 49.1,48.31 48.92,48.49 48.92,48.9 49.1,49.07 49.1,49.53 48.95,49.68 48.95,50.14 49.07,50.27 49.07,50.65 48.92,50.8 48.92,51.28 49.1,51.46 49.1,52 49.45,52.36 49.45,52.55 49.84,52.93 50.03,52.93 50.34,53.25 50.34,53.49 50.65,53.8 50.89,53.8 51.23,54.13 51.23,54.38 51.59,54.74 51.83,54.74 52.17,55.08 52.17,55.3 52.48,55.6 52.7,55.6 53.19,56.09 53.19,57.95 52.98,58.17 52.48,58.17 52.07,57.76 U$1.143
CLK1_P
  Top 0.203: HDMI_1.10 68.81,44.06 68.48,43.74 67.53,43.74 66.31,42.52 53.57,42.52 U1.16 53.44,42.6 51.11,42.6 49.51,44.2 49.51,51.83 53.59,55.92 53.59,58.12 53.15,58.57 52.48,58.57 52.07,58.98 U$1.144
CLK2_N
  Top 0.203: HDMI_2.12 66.25,18.93 64.43,20.75 63.86,20.75 63.83,20.73 62.9,20.73 U2.15 61.89,20.76 61.77,20.88 61.49,20.88 arc90 60.81,20.19 60.81,17.27 arc90 61.62,16.46 66.52,16.46 arc-90 67.56,15.42 arc-90 66.55,14.4 66.06,14.4 arc90 65.41,13.74 65.41,13.66 arc90 66.04,13.03 67.36,13.03 arc-90 68.48,11.91 arc-90 67.49,10.92 65.89,10.92 arc90 65.33,10.36 arc90 65.73,9.96 69.39,9.96 arc-90 70.28,9.07 arc-90 69.32,8.1 64.9,8.1 arc90 63.73,6.93 63.73,5.79 arc-90 62.79,4.85 62.61,4.85 arc90 62.23,4.47 U$1.120
CLK2_P
  Top 0.203: HDMI_2.10 68.81,19.93 68.22,19.36 67.79,19.36 67.61,19.53 66.98,19.53 66.79,19.35 66.43,19.35 65.86,19.91 65.86,20.12 65.25,20.73 65.03,20.73 64.6,21.16 64.06,21.16 63.8,21.41 U2.16 61.9,21.41 61.77,21.29 61.49,21.29 arc90 60.4,20.19 60.4,19.86 60.22,19.68 60.22,19.13 60.38,18.97 60.38,18.39 60.22,18.24 60.22,17.6 60.4,17.42 60.4,17.27 arc90 61.62,16.05 62.15,16.05 62.31,15.9 62.92,15.9 63.07,16.05 63.6,16.05 63.75,15.9 64.34,15.9 64.49,16.05 65.1,16.05 65.25,15.9 65.86,15.9 66.02,16.05 66.52,16.05 arc-90 67.16,15.42 arc-90 66.55,14.81 65.99,14.81 arc90 64.97,13.79 64.97,13.61 arc90 65.96,12.62 67.36,12.62 arc-90 68.07,11.91 arc-90 67.49,11.33 67.23,11.33 67.08,11.48 66.19,11.48 66.04,11.33 65.86,11.33 arc90 64.9,10.36 arc90 65.71,9.55 69.34,9.55 arc-90 69.86,9.03 arc-90 69.39,8.56 69.27,8.56 69.09,8.74 68.53,8.74 68.38,8.59 67.74,8.59 67.59,8.74 66.88,8.74 66.73,8.59 66.04,8.59 65.86,8.76 65.15,8.76 64.95,8.56 arc90 63.32,6.93 63.32,5.79 arc-90 62.79,5.26 62.64,5.26 arc-90 62.2,5.69 62.2,6.33 arc-90 U$1.121
CTHPD1
  Top 0.203: U1.12 44.55,40.67 43.99,41.22 43.99,51.84 44.41,52.26 R27.2 44.45,54.01 U$1.7
CTHPD2  (via drill 0.35)
  Top 0.203: U2.12 56.04,19.46 v55.7,19.13 | 48.48,9.14 47.04,9.14 v46.99,9.09
  Top 0.254: R28.2 48.48,9.14
  Bottom 0.203: v55.7,19.13 46.99,10.41 v46.99,9.09 U$1.102
D01_N
  Top 0.203: HDMI_1.9 68.74,44.56 68.48,44.83 67.56,44.83 67.36,44.63 66.78,44.63 66.57,44.83 65.79,44.83 64.82,43.87 64.36,43.87 64.19,43.69 63.65,43.69 63.5,43.84 63.17,43.84 63.02,43.69 62.64,43.69 62.46,43.87 62.08,43.87 61.87,43.66 61.47,43.66 61.27,43.87 60.83,43.87 60.66,43.69 60.25,43.69 60.07,43.87 59.66,43.87 59.49,43.69 59.05,43.69 58.88,43.87 58.47,43.87 58.32,43.71 57.91,43.71 57.76,43.87 57.3,43.87 57.15,43.71 56.72,43.71 56.57,43.87 56.13,43.87 55.98,43.71 55.55,43.71 55.4,43.87 54.97,43.87 54.41,43.31 53.5,43.31 U1.17 51.74,43.27 50.04,44.98 50.04,50.66 50.46,51.08 50.46,51.24 50.75,51.54 50.92,51.54 51.18,51.8 51.18,51.99 51.38,52.2 51.58,52.2 51.84,52.46 51.84,52.63 52.02,52.81 52.19,52.81 52.45,53.07 52.45,53.24 52.7,53.49 52.88,53.49 53.16,53.78 53.16,53.98 53.49,54.3 53.69,54.3 54.03,54.64 54.03,54.81 54.36,55.14 54.53,55.14 54.79,55.41 54.79,55.6 55.14,55.96 55.34,55.96 55.75,56.37 55.75,57.83 55.41,58.17 55.04,58.17 54.61,57.73 U$1.141
D01_P
  Top 0.203: HDMI_1.7 68.81,45.56 68.48,45.24 65.55,45.24 64.58,44.27 54.78,44.27 54.43,43.92 U1.18 53.41,43.87 51.72,43.87 50.44,45.14 50.44,50.49 56.16,56.2 56.16,58 55.58,58.57 55.04,58.57 54.61,59 U$1.142
D02_N
  Top 0.203: HDMI_2.9 66.73,20.43 65.1,22.06 U2.17 61.88,22.06 61.77,22.17 60.48,22.17 59.36,21.05 59.36,18.29 arc-90 58.22,17.14 56.62,17.14 arc90 55.94,16.47 arc90 56.67,15.75 58.8,15.75 arc-90 59.91,14.64 arc-90 58.85,13.59 57.76,13.59 arc90 57.17,13.01 arc90 57.81,12.37 60.83,12.37 arc90 61.52,13.06 61.52,13.16 arc-90 62.59,14.22 arc-90 63.7,13.11 63.7,9.7 arc-90 62.79,8.79 61.7,8.79 arc90 61.16,8.26 61.16,5.82 arc-90 60.22,4.88 59.94,4.88 arc90 59.54,4.47 59.54,3.96 arc90 U$1.118
D02_P
  Top 0.203: HDMI_2.7 68.78,21.43 68.2,20.85 66.9,20.85 66.27,21.49 66.27,21.74 65.81,22.2 65.56,22.2 65.28,22.48 64.21,22.48 63.98,22.71 U2.18 61.91,22.71 61.77,22.58 61.29,22.58 61.14,22.73 60.45,22.73 60.2,22.48 58.95,21.23 58.95,18.29 arc-90 58.22,17.55 58.04,17.73 57.68,17.73 57.53,17.58 57.17,17.58 57.02,17.73 56.69,17.73 56.52,17.55 arc90 55.45,16.48 arc90 56.59,15.34 56.74,15.19 57.2,15.19 57.35,15.34 57.73,15.34 57.89,15.19 57.89,15.16 58.37,15.16 58.55,15.34 58.8,15.34 arc-90 59.5,14.64 arc-90 58.85,13.99 58.7,14.15 57.86,14.15 57.71,13.99 arc90 56.69,12.98 arc90 57.71,11.96 57.84,11.96 57.96,11.84 58.42,11.84 58.55,11.96 58.95,11.96 59.08,11.84 59.51,11.84 59.64,11.96 60.12,11.96 60.27,11.81 60.71,11.81 60.86,11.96 arc90 61.92,13.03 arc-90 62.65,13.75 arc-90 63.3,13.11 63.3,12.93 63.14,12.78 63.14,12.39 63.3,12.24 63.3,11.86 63.14,11.71 63.14,11.3 63.3,11.15 63.3,10.77 63.17,10.64 63.17,10.26 63.3,10.13 63.3,9.78 arc-90 62.71,9.2 62.43,9.2 62.28,9.35 61.85,9.35 61.7,9.2 arc90 60.76,8.26 60.76,7.92 60.6,7.77 60.6,7.32 60.76,7.16 60.76,5.82 arc-90 60.22,5.28 59.94,5.28 arc-90 59.59,5.64 59.59,6.25 arc-90 U$1.119
D11_N  (1 unrouted)
  Top 0.203: HDMI_1.6 68.79,46.06 68.53,46.33 66.22,46.33 arc-90 64.72,47.83 64.72,48.21 arc90 63.83,49.1 61.95,49.1 arc90 60.94,48.08 60.94,46.74 arc-90 59.54,45.34 55.91,45.34 55.78,45.21 55.42,45.21 55.3,45.34 54.86,45.34 54.75,45.22 U1.20 | 57.15,57.76 U$1.139 57.15,57.81 57.53,58.19 57.88,58.19 58.27,57.8 58.27,56.49 57.61,55.83 57.38,55.83 57.1,55.55 57.1,55.32 56.74,54.97 56.52,54.97 56.19,54.63 56.19,54.41 55.8,54.03 55.58,54.03 55.37,53.82 55.37,53.59 55.07,53.29 54.84,53.29 54.53,52.98 54.53,52.76 54.23,52.45 54.03,52.45 53.77,52.2 53.77,51.99 53.52,51.74 53.31,51.74 53.06,51.49 53.06,51.28 52.78,51 52.58,51 52.17,50.6 52.17,50.42 51.79,50.04 51.61,50.04 51.36,49.78 51.36,49.56 50.98,49.18 50.98,46.65 52.39,45.24 53.62,45.24
D11_P  (1 unrouted)
  Top 0.203: HDMI_1.4 68.81,47.06 68.48,46.74 66.22,46.74 arc-90 65.13,47.83 65.13,48.21 arc90 63.83,49.51 61.95,49.51 arc90 60.53,48.08 60.53,46.74 arc-90 59.54,45.74 54.48,45.74 54.38,45.85 53.49,45.85 U1.21 | U$1.140 57.15,59.03 57.58,58.6 58.05,58.6 58.67,57.97 58.67,56.3 51.38,49.01 51.38,46.82 52.36,45.85 53.52,45.85
D12_N  (1 unrouted)
  Top 0.203: HDMI_2.6 68.79,21.93 68.68,22.05 67.1,22.05 65.12,24.03 62.88,24.03 U2.20 61.84,24.01 61.72,24.13 60.38,24.13 arc-90 58.98,25.53 58.98,27.09 58.31,27.76 54.47,27.76 52.93,26.23 52.93,18.73 54.05,17.61 54.05,16.07 52.7,14.72 52.7,13.49 54.74,11.46 56.5,11.46 57.78,10.17 57.78,8.62 58.62,7.78 58.62,7.09 | U$1.116 arc90 57.17,3.83 57.17,4.57 arc-90 57.45,4.85 57.91,4.85 arc90 58.62,5.56 58.62,7.25
D12_P  (4 unrouted)
  Top 0.203: HDMI_2.4 68.81,22.93 68.33,22.45 67.28,22.45 66.98,22.76 66.98,23.01 66.65,23.34 66.4,23.34 65.99,23.75 65.99,23.98 65.53,24.43 64.11,24.43 63.88,24.66 U2.21 61.85,24.66 61.72,24.54 60.38,24.54 arc-90 59.38,25.53 59.38,26.14 | 59.38,26.09 59.38,27.39 58.59,28.18 58.06,28.18 57.42,28.18 57.24,28.36 56.71,28.36 56.53,28.18 55.87,28.18 55.7,28.36 55.14,28.36 54.96,28.18 54.19,28.18 54.17,28.17 54.15,28.17 53.76,27.79 53.57,27.79 53.16,27.38 53.16,27.2 52.53,26.57 52.53,25.73 52.35,25.55 52.35,24.97 52.53,24.79 52.53,24.16 52.35,23.98 52.35,23.37 52.53,23.19 52.53,22.55 52.35,22.38 52.35,21.79 52.53,21.61 52.53,21.06 52.35,20.88 52.35,20.3 52.53,20.12 52.53,19.36 52.35,19.18 52.35,18.72 53.65,17.42 53.65,16.26 53.06,15.67 52.83,15.67 52.3,15.14 52.3,14.66 52.15,14.5 52.15,13.99 52.3,13.84 52.3,13.06 52.65,12.7 52.91,12.7 53.37,12.24 53.37,12.01 53.85,11.53 54.08,11.53 54.56,11.05 55.52,11.05 55.7,10.87 56.49,10.87 56.95,10.41 56.95,10.18 57.38,9.75 57.38,8.45 58.22,7.61 58.22,7.09 | U$1.117 arc-90 57.17,6.33 57.17,5.51 arc90 57.43,5.26 57.91,5.26 arc90 58.22,5.56 58.22,7.14
D21_N  (1 unrouted)
  Top 0.203: HDMI_1.3 68.82,47.56 68.5,47.88 67.74,47.88 67.49,48.13 67.31,48.13 67.03,48.41 67.03,48.58 66.77,48.84 66.57,48.84 66.32,49.1 66.32,49.3 66.04,49.58 65.84,49.58 65.58,49.84 65.58,50.04 65.3,50.32 65.1,50.32 64.87,50.55 64.87,50.77 64.53,51.1 64.16,51.1 64.03,50.98 63.63,50.98 63.5,51.1 63.09,51.1 62.97,50.98 62.51,50.98 62.38,51.1 61.98,51.1 61.85,50.98 61.42,50.98 61.29,51.1 60.86,51.1 60.58,50.83 60.58,50.6 60.38,50.39 60.16,50.39 59.94,50.18 59.94,49.96 59.74,49.76 59.51,49.76 59.26,49.51 59.26,49.25 59.08,49.07 58.83,49.07 58.6,48.84 58.6,48.59 58.4,48.39 58.14,48.39 57.86,48.11 57.86,47.85 57.63,47.62 57.38,47.62 57.07,47.32 57.07,47.09 56.82,46.84 56.59,46.84 56.27,46.52 55.79,46.52 55.65,46.38 55.09,46.38 54.95,46.52 U1.22 | U$1.137 59.69,57.91 59.99,58.22 60.42,58.22 60.76,57.88 60.76,56.34 59.72,55.3 59.44,55.3 59.18,55.04 59.18,54.76 58.88,54.46 58.65,54.46 58.37,54.18 58.37,53.95 58.12,53.7 57.89,53.7 57.58,53.39 57.58,53.16 57.28,52.86 57.05,52.86 56.79,52.6 56.79,52.38 56.49,52.07 56.29,52.07 56.01,51.79 56.01,51.59 55.73,51.31 55.5,51.31 55.24,51.05 55.24,50.83 54.97,50.55 54.74,50.55 54.46,50.27 54.46,50.04 54.18,49.76 53.95,49.76 53.65,49.45 53.65,49.23 53.33,48.92 52.47,48.92 51.89,48.34 51.89,47.08 52.37,46.61 53.42,46.61
D21_P  (1 unrouted)
  Top 0.203: HDMI_1.1 68.78,48.56 68.5,48.28 67.93,48.28 64.7,51.51 60.67,51.51 56.1,46.94 54.71,46.94 54.48,47.17 U1.23 | U$1.138 59.69,58.93 59.99,58.62 60.59,58.62 61.16,58.05 61.16,56.15 53.53,48.51 52.64,48.51 52.3,48.18 52.3,47.25 52.46,47.09 53.44,47.09
D22_N
  Top 0.203: HDMI_2.3 69.83,23.46 67.59,23.46 65.73,25.32 62.88,25.32 U2.22 61.88,25.31 61.8,25.4 61.21,25.4 60.43,26.18 60.43,27.98 58.9,29.52 53.27,29.52 51.08,27.32 51.08,12.66 56.08,7.65 56.08,5.82 arc-90 55.14,4.88 55.12,4.88 arc90 54.56,4.32 54.56,3.86 arc90 U$1.114
D22_P  (3 unrouted)
  Top 0.203: HDMI_2.1 68.81,24.43 68.25,23.88 67.75,23.88 67.11,24.52 67.11,24.71 66.65,25.17 66.45,25.17 65.9,25.73 63.98,25.73 63.75,25.96 U2.23 61.95,25.96 61.8,25.81 61.37,25.81 60.83,26.35 60.83,26.82 60.96,26.95 60.96,27.58 60.83,27.71 60.83,28.17 59.94,29.06 59.94,29.23 59.51,29.67 59.32,29.67 59.05,29.94 58.49,29.94 58.34,30.09 57.7,30.09 57.55,29.94 56.91,29.94 56.76,30.09 56.13,30.09 55.97,29.94 55.34,29.94 | 55.37,29.94 55.21,30.09 54.58,30.09 54.42,29.94 53.79,29.94 53.64,30.09 53.26,30.09 50.55,27.38 50.55,26.67 50.67,26.54 50.67,25.91 50.52,25.76 50.52,25.12 50.67,24.97 50.67,24.33 50.52,24.18 50.52,23.52 50.67,23.37 50.67,22.73 50.52,22.58 50.52,21.95 50.67,21.79 50.67,21.16 50.52,21.01 50.52,20.37 50.67,20.22 50.67,19.58 50.52,19.43 50.52,18.8 50.67,18.64 50.67,18.01 50.52,17.86 50.52,17.22 50.67,17.07 50.67,16.43 50.52,16.28 50.52,15.65 50.67,15.49 50.67,14.86 50.52,14.71 50.52,14.07 50.67,13.92 50.67,12.49 51.64,11.52 51.64,11.31 52.09,10.86 52.3,10.86 52.76,10.4 52.76,10.19 53.21,9.74 53.42,9.74 53.87,9.29 53.87,9.07 54.32,8.62 54.54,8.62 55.68,7.49 55.68,5.82 arc-90 55.14,5.28 55.02,5.28 arc-90 54.61,5.69 U$1.115
GND  (via drill 0.35)
  Top 0.203: R23.1 32,37.5 v32,38.48 | R24.1 31.46,34.42 v32.77,34.42 | R25.1 v32.77,31.75 | R26.1 v32.77,29.21 | R19.1 v32.77,21.59 | R20.1 v32.77,19.05 | R21.1 v32.77,16.51 | R22.1 v32.77,13.97 | X1.5 5.4,17.79 5.38,17.8 4.29,17.8 CAMERA1.5 | X1.6 4.78,16.29 CAMERA1.6 | X2.5 5.07,33.62 CAMERA2.5 | X2.6 5.57,32.12 CAMERA2.6 | HDMI_1.2 71.77,48.06 v71.86,47.98 | HDMI_1.5 71.77,46.56 v71.86,46.48 | HDMI_1.8 71.8,45.06 71.83,45.03 v71.83,45.06 | HDMI_1.11 71.83,43.56 v71.86,43.59 | HDMI_1.17 71.86,40.56 v71.91,40.62
  Top 0.254: TP_GND.TP 10.34,27.94 8.96,29.32 CAMERA2.6 | HDMI_2.2 71.59,23.93 | HDMI_2.5 71.62,22.43 | HDMI_2.8 v71.62,20.93 | HDMI_2.11 71.65,19.43 | HDMI_2.17 71.68,16.43 v71.7,16.46
  Top 0.305: C5.2 55.28,23.36 U2.6 58.42,23.36 | U2.19 62.84,23.34 v58.83,23.34 | U2.14 63.88,20.11 | 64.39,18.4 C6.2 | 71.59,23.93 v71.63,23.9 | 71.62,22.43 v71.68,22.38 | v71.62,20.93 v71.63,20.93 | 71.65,19.43 71.68,19.41 v71.7,19.46
  Top 0.406: 63.88,20.11 64.39,19.61 64.39,18.4 | C7.2 v65.71,27.99 | C3.2 46.08,44.57 v46.28,44.57 U1.6 | U1.19 52.09,44.57 v51.8,44.87 | C8.2 57.63,50.77 v57.68,50.77 | U1.14 54.77,41.32 v55.19,40.89 55.74,40.35 C4.2 | v58.83,23.34 58.45,23.34 58.42,23.36
  Top 0.61: v10.19,54.08 10.19,52.85 C1.2 10.21,52.82 | 10.21,52.82 v10.21,51.54 10.2,51.52 10.2,50.29 | 10.2,50.29 C2.2 | v8.91,52.81 10.2,52.81 10.21,52.82 | v8.94,50.14 10.05,50.14 10.16,50.25 | v10.16,48.84 10.16,50.25 | 10.16,50.25 10.2,50.29 | v18.59,44.42 18.59,45.7 Y1.P$3 | v19.68,44.45 19.53,44.6 19.53,45.62 19.05,46.1 Y1.P$3 | v20.98,46.66 20.48,46.16 Y1.P$3 | v20.95,45.57 19.64,45.57 Y1.P$3
  Top 0.813: R29.2 v73.28,33.02 C10.2 | C9.2 v73.41,30.48 R30.2
  Route2 0.305: v71.63,23.9 71.83,23.9
  other vias: 64.27,18.29
  pour Route2: 76.83,64.14 1.98,64.14 -0.64,61.58 -0.64,1.91 1.91,-0.64 76.83,-0.64 79.38,1.91 79.38,61.59
HP1
  Top 0.203: HDMI_1.19 67.83,37.54 53.31,37.54 48.88,41.97 U1.10
HP1_M
  Top 0.203: 45.77,45.9 45.74,45.9 | 45.74,45.9 45.68,45.96 44.78,46.86 44.78,51.16 46.99,53.37 U$1.5 | 45.74,45.9 46.42,45.22 U1.5 | U1.4 45.77,45.87 45.74,45.9
HP2  (via drill 0.35)
  Top 0.203: 57.17,20.76 U2.10 55.82,20.76 v55.72,20.66 | v69.01,14.63 69.82,15.44 HDMI_2.19
  Bottom 0.203: v55.72,20.66 62.95,20.66 69.01,14.61 v69.01,14.63
HP2_M  (via drill 0.35)
  Top 0.203: U2.4 55.45,24.66 | 55.45,24.66 v55.42,24.69 | U2.5 56.1,24.01 55.45,24.66
  Bottom 0.203: v55.42,24.69 44.45,13.72 U$1.100
LINE_1_1
  Top 0.305: R4.1 R14.1 25.82,15.24 27.94,15.24 | 27.94,15.24 34.29,15.24 40.64,21.59 40.64,58.42 U$1.12 | R22.2 29.21,13.97 27.94,15.24
LINE_1_2
  Top 0.305: R3.1 R13.1 25.82,17.78 27.94,17.78 | 27.94,17.78 34.29,17.78 39.37,22.86 U$1.11 | R21.2 29.21,16.51 27.94,17.78
LINE_1_3
  Top 0.305: R2.1 R12.1 25.82,20.32 27.94,20.32 | 27.94,20.32 34.29,20.32 38.1,24.13 38.1,58.42 U$1.15 | R20.2 29.21,19.05 27.94,20.32
LINE_1_4
  Top 0.305: R1.1 R11.1 25.82,22.86 27.94,22.86 | 27.94,22.86 33.02,22.86 36.83,26.67 U$1.14 | R19.2 29.21,21.59 27.94,22.86
LINE_2_1
  Top 0.305: R10.1 R18.1 25.82,30.48 27.94,30.48 | 27.94,30.48 34.29,30.48 35.56,31.75 35.56,58.42 U$1.17 | R26.2 29.21,29.21 27.94,30.48
LINE_2_2
  Top 0.305: R9.1 R17.1 25.82,33.02 27.94,33.02 | 27.94,33.02 33.02,33.02 34.29,34.29 U$1.16 | R25.2 29.21,31.75 27.94,33.02
LINE_2_3
  Top 0.305: R8.1 R16.1 25.82,35.56 27.94,35.56 | 27.94,35.56 31.75,35.56 33.02,36.83 33.02,58.42 U$1.22 | R24.2 29.21,34.29 27.94,35.56
LINE_2_4
  Top 0.254: R7.1 21.17,39.8
  Top 0.305: R7.1 R15.1 25.82,38.1 27.94,38.1 | 27.94,38.1 30.48,38.1 31.75,39.37 U$1.21 | R23.2 29.21,36.83 27.94,38.1
N$1
  Top 0.305: 19.68,24.13 20.95,24.13
N$2
  Top 0.305: 19.68,21.59 20.95,21.59
N$3
  Top 0.305: 19.68,19.05 20.95,19.05
N$4
  Top 0.305: 19.68,16.51 20.95,16.51
N$5  (1 unrouted)
  Top 0.254: LINE_1_4.TP 2.77,24.13 CAMERA1.1
  Top 0.305: LINE_1_4.TP R1.2
N$6  (1 unrouted)
  Top 0.254: LINE_1_3.TP 14.63,22.2 CAMERA1.2
  Top 0.305: 14.95,21.3 LINE_1_3.TP R2.2
N$7  (1 unrouted)
  Top 0.254: LINE_1_2.TP 14.83,19.05 13.16,20.73 3.22,20.73 CAMERA1.3
  Top 0.305: LINE_1_2.TP R3.2
N$8  (1 unrouted)
  Top 0.254: CAMERA1.4 3.73,19.24 13.17,19.24 13.72,18.69 13.72,18.03 LINE_1_1.TP
  Top 0.305: LINE_1_1.TP R4.2
N$9  (1 unrouted)
  Top 0.254: 20.95,39.37 R7.2 LINE_4.TP 15.16,39.45 2.9,39.45 CAMERA2.1
N$10  (1 unrouted)
  Top 0.254: 14.95,36.54 LINE_2_3.TP | LINE_2_3.TP R8.2 20.95,36.83 | LINE_2_3.TP 13.89,38.18 3.63,38.18 CAMERA2.2
N$11  (1 unrouted)
  Top 0.254: 20.95,34.29 R9.2 LINE_2_2.TP 15.24,34.37 13.03,36.58 4.03,36.58 CAMERA2.3
N$12  (1 unrouted)
  Top 0.254: 20.95,31.75 R10.2 LINE_2_1.TP 13.79,33.2 13.79,34.31 13.08,35.03 4.48,35.03 CAMERA2.4
N$13  (3 unrouted)
  Top 0.813: C9.1 R29.1 70.27,34.21 70.85,34.79 HDMI_1.P2
N$14  (3 unrouted)
  Top 0.813: HDMI_2.P4 76.42,28.2 R30.1 C10.1
PROG_CLK
  Top 0.193: 19.07,50.38 arc-90 Y1.P$4
  Top 0.305: U$1.51 14.17,59.69 arc-90 15.27,58.6 15.27,55.88 arc90 16.46,54.69 17.78,54.69 arc-90 19.07,53.39 19.07,50.38
  pour Top (no thermals): 18.31,51.36 19.02,52.07 19.13,52.07 19.79,51.41 19.79,51.31 18.36,51.31
SCL1
  Top 0.203: HDMI_1.15 68.39,41.56 65.15,38.33 53.62,38.33 48.68,43.27 U1.8
SCL1_M
  Top 0.203: U1.2 46.53,47.17 45.85,47.85 45.85,50.6 49.53,54.28 U$1.1
SCL2  (via drill 0.35)
  Top 0.203: U2.8 56.21,22.06 55.79,22.48 v55.72,22.48 | v68,17.86 68.42,17.43 HDMI_2.15
  Bottom 0.203: v55.72,22.48 63.37,22.48 v68,17.86
SCL2_M  (via drill 0.35)
  Top 0.203: U2.2 56.21,25.96 v55.42,26.75
  Bottom 0.203: v55.42,26.75 39.37,10.69 U$1.95
SCL_C
  Top 0.305: Y1.P$2 16.51,44.45 17.78,43.18 25.4,43.18 26.67,44.45 R5.1 27.09,48.68 27.94,49.53 27.94,55.88 U$1.23
SDA1
  Top 0.203: U1.9 48.74,42.62 53.45,37.91 65.42,37.91 68.57,41.06 HDMI_1.16
SDA1_M
  Top 0.203: U1.3 46.06,46.52 45.29,47.3 45.29,50.83 48.23,53.77 48.23,58.4 U$1.2
SDA2  (via drill 0.35)
  Top 0.203: U2.9 55.9,21.41 v55.74,21.57 | HDMI_2.16 68.48,16.93 68.43,16.89 68.12,16.89 v68.1,16.87
  Bottom 0.203: v55.74,21.57 63.06,21.57 67.67,16.97 68.1,16.97 v68.1,16.87
SDA2_M  (via drill 0.35)
  Top 0.203: U2.3 55.93,25.31 v55.41,25.84
  Bottom 0.203: v55.41,25.84 41.91,12.34 U$1.98
SDA_C
  Top 0.305: Y1.P$1 13.97,45.72 17.78,41.91 25.4,41.91 29.21,45.72 R6.1 30.48,49.95 30.48,58.42 U$1.24

### Text on the board
tNames: Align with Mojo / Analog Port | Test Pads | Signal Config | Signal / Names | LINE 4 | LINE 3 | LINE 2 | Series / 0 Ohm / Until / Cut | MojoV3 HDMI Trigger v1.3 / Dr. Daniel L. Lau / Matt Ruffner / Ying Yu / University of Kentucky 2019 | LINE 1 | GND | 3.3V / Pull / Up | 0V / Pull / Down | LINE 4 | LINE 3 | LINE 2 | LINE 1 | Component Size: 0603 (1208m)
bNames: Basler Pinout Reference | PIN 1 -> LINE 3 / PIN 2 -> LINE 1 / PIN 3 -> LINE 4 / PIN 4 -> LINE 2 / / PIN 5 -> GND / PIN 6 -> GND